# Altium schematic sheet other.SchDoc
size A4; SheetNumber: 7; SheetTotal: 7
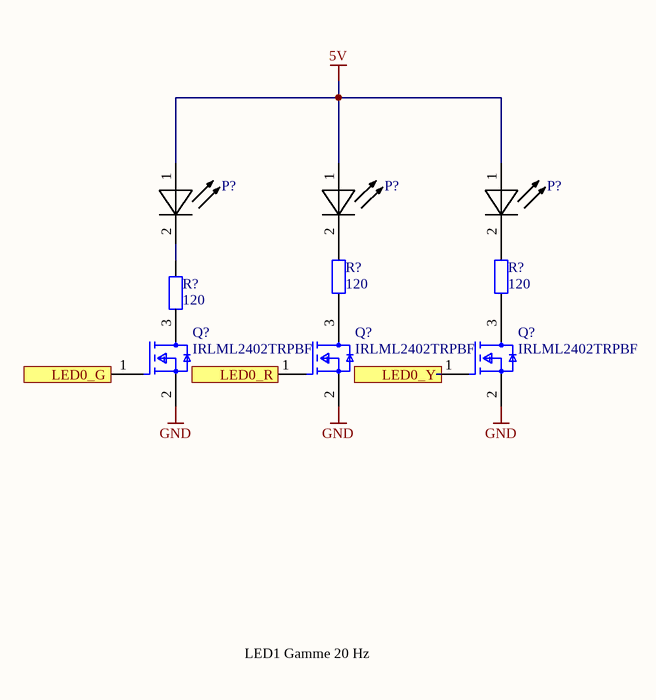
[diagram p0: other.SchDoc]

## Parts
(Parts that share a designator on the sheet are numbered #1, #2 ... from top to bottom, then left to right.)
P?#1  20mA/RD  [Kingbright_L-424IDT]  (value not drawn)
P?#2  20mA/RD  [Kingbright_L-424IDT]  (value not drawn)
P?#3  20mA/RD  [Kingbright_L-424IDT]  (value not drawn)
Q?#1  IRLML2402TRPBF  [FP-Micro3-IPC_B]
Q?#2  IRLML2402TRPBF  [FP-Micro3-IPC_B]
Q?#3  IRLML2402TRPBF  [FP-Micro3-IPC_B]
R?#1  120  [RESC2012X06M]
R?#2  120  [RESC2012X06M]
R?#3  120  [RESC2012X06M]

## Ports
LED0_G, LED0_R, LED0_Y

## Nets
5V: P?#1.1(A) P?#2.1(A) P?#3.1(A)
GND: Q?#1.2(S) Q?#2.2(S) Q?#3.2(S)
LED0_G: Q?#1.1(G) ; port LED0_G
LED0_Y: Q?#3.1(G) ; port LED0_Y
NetP?#1_2: P?#1.2(K) R?#3.1
NetP?#2_2: P?#2.2(K) R?#1.1
NetP?#3_2: P?#3.2(K) R?#2.1
NetQ?#2_3: Q?#2.3(D) R?#1.2
NetQ?#3_3: Q?#3.3(D) R?#2.2

Not connected (* = marked no-connect by the designer): Q?#1 3(D); Q?#2 1(G); R?#3 2

## Notes on the sheet
- LED1 Gamme 20 Hz

## Library data of the parts
P?#1-P?#3 = CMP-062-000007-1: LED 3mm Cylinder 20 mA 2V 625nm Red; Manufacturer Number: L-424IDT; Manufacturer: Kingbright; PN: PN-643196; TemperatureRange: -40°C to +85°C; Current: 20mA; IsStocked: False; Supplier 1: Farnell; SubCategory: Leds; Supplier Part Number 1: 1142497; Value: 20mA/RD; Supplier Price 1: 0.504; Voltage: 2V; Category: Optoelectronics
Q?#1-Q?#3 = CMP-32901-000179-1: MOSFET N-CH 20V 1.2A SOT-23; Max Power Dissipation: 540mW; Gate to Source Voltage (Vgs): 12V; Drain to Source Resistance: 350mR; Rise Time: 9.5ns; Threshold Voltage: 700mV; Turn-On Delay Time: 2.5ns; Input Capacitance: 110pF; Element Configuration: Single; Power Dissipation: 540W; Turn-Off Delay Time: 9.7ns; Rds On Max: 250mR; REACH SVHC: No SVHC; Mount: Surface Mount; Packaging: Tape and Reel; Height: 0.04inch; Drain to Source Voltage (Vdss): 20V; Length: 0.119inch; Contact Plating: Tin; Continuous Drain Current (ID): 1.2A; Lead Free: Lead Free; Drain to Source Breakdown Voltage: 20V; Max Dual Supply Voltage: 20V; Number of Pins: 3; Halogen Free: Halogen Free; Max Operating Temperature: 150°C; Case/Package: SOT-23; Min Operating Temperature: -55°C; Width: 0.055inch
R?#1-R?#3 = Res2: Resistor; Published: 8-Jun-2000; LatestRevisionDate: 17-Jul-2002; LatestRevisionNote: Re-released for DXP Platform.; PackageReference: AXIAL-0.4; Publisher: Altium Limited; PackageDescription: Axial Device, Thru-Hole; 2 Leads; 0.4 in Pin Spacing; Value: 120